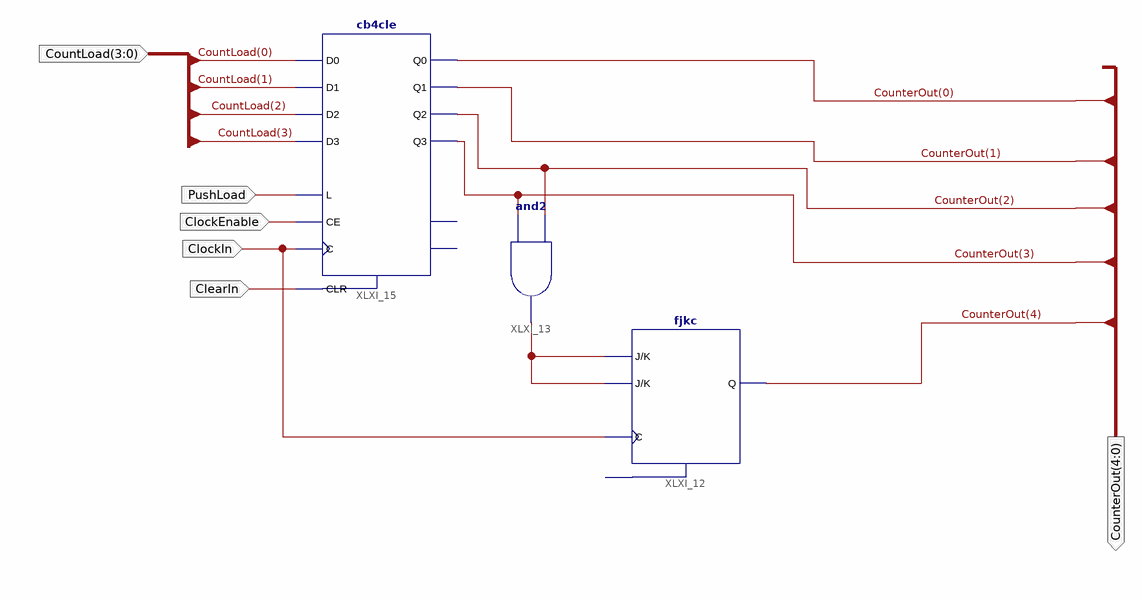
[diagram p0: schematic sheet 1]
// Xilinx ISE schematic ProgramCounter.sch (spartan3e) as structural Verilog: 3 symbols, 6 ports
module ProgramCounter (
  input  ClockIn,
  input  ClearIn,
  input  ClockEnable,
  input  [3:0] CountLoad,
  input  PushLoad,
  output [4:0] CounterOut
);

  wire XLXN_84;

  fjkc XLXI_12 (.C(ClockIn), .J(XLXN_84), .K(XLXN_84), .Q(CounterOut[4]));  // open: CLR
  and XLXI_13 (XLXN_84, CounterOut[3], CounterOut[2]);
  cb4cle XLXI_15 (
    .C(ClockIn), .CE(ClockEnable), .CLR(ClearIn), .D0(CountLoad[0]), .D1(CountLoad[1]), .D2(CountLoad[2]),
    .D3(CountLoad[3]), .L(PushLoad), .Q0(CounterOut[0]), .Q1(CounterOut[1]), .Q2(CounterOut[2]),
    .Q3(CounterOut[3]));  // open: CEO, TC
endmodule
